# EAGLE design untitled (EAGLE 9.6.2)
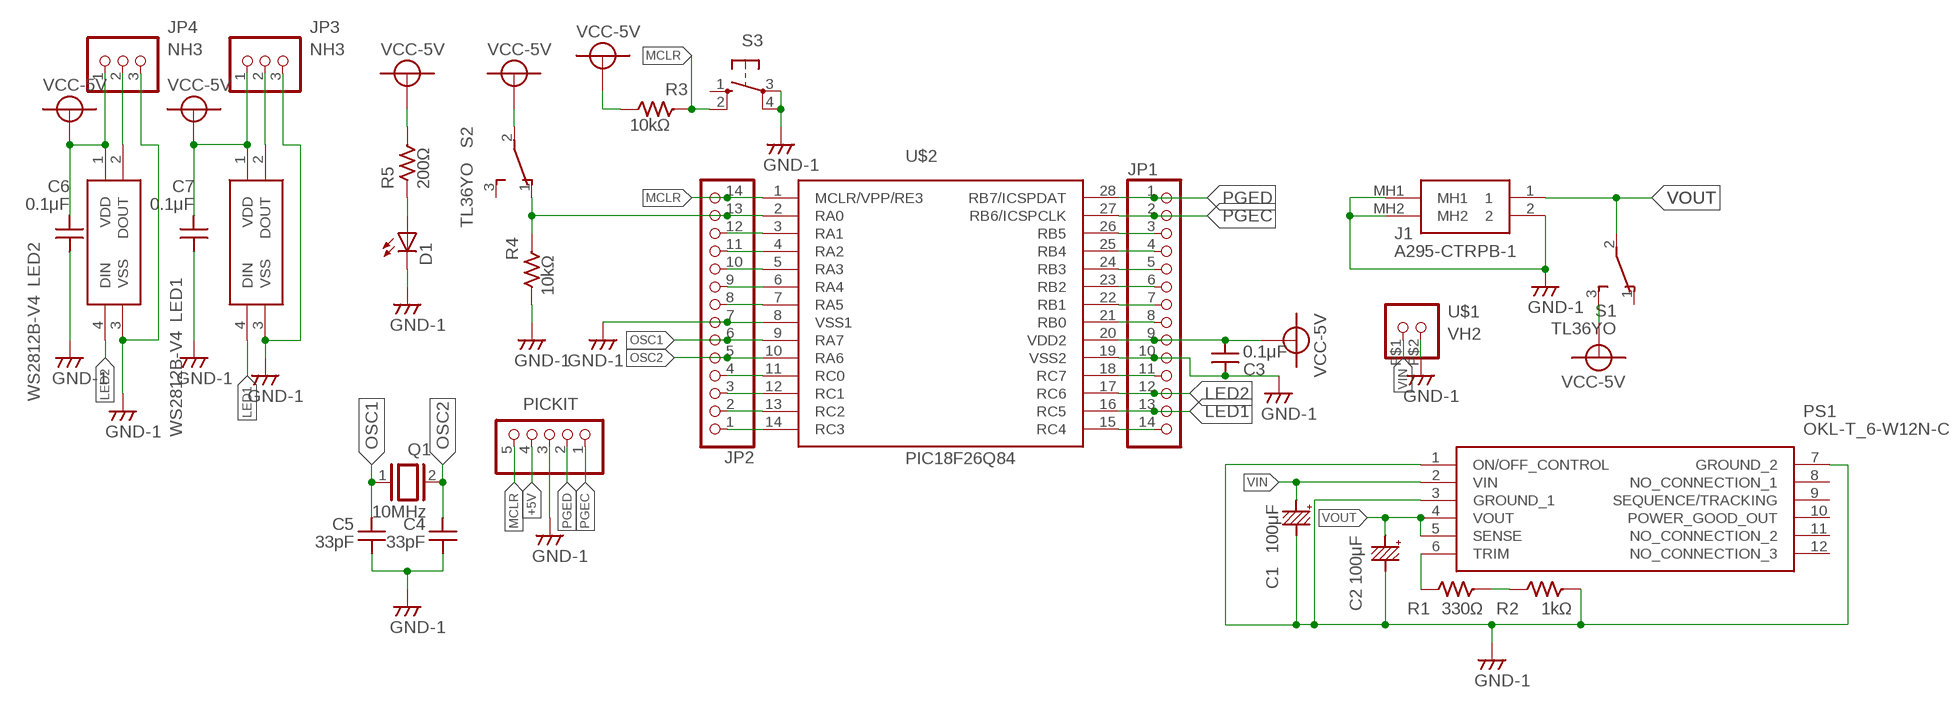
[diagram p0: schematic, sheet 1]

## Parts
C1  100μF  C+25V100  [CC:3]
C2  100μF  C+25V100  [CC:3]
C3  0.1μF  CC2.54  [C:1]
C4  33pF  CC2.54  [C:1]
C5  33pF  CC2.54  [C:1]
C6  0.1μF  CC1068  [C1608]
C7  0.1μF  CC1068  [C1608]
D1  LED""""  [CHIPLED_0603]
J1  A295-CTRPB-1  [A295CTRPB1]
JP1  PINHD-1X14  [1X14]
JP2  PINHD-1X14  [1X14]
JP3  NH3  [NH3]
JP4  NH3  [NH3]
LED1  WS2812B-V4  [WS2812BV4]
LED2  WS2812B-V4  [WS2812BV4]
PICKIT  PINHD-1X5/90  [1X05/90]
PS1  OKL-T_6-W12N-C  [OKLT6W12NC]
Q1  10MHz  XTAL/S  [QS]
R1  330Ω  R3216(1206)  [C3216]
R2  1kΩ  R2012  [2012]
R3  10kΩ  R2012  [2012]
R4  10kΩ  R2012  [2012]
R5  200Ω  R3216(1206)  [C3216]
S1  TL36YO  [TL3XYO]
S2  TL36YO  [TL3XYO]
S3  10-XX  [B3F-10XX]
U$1  VH2  [VH2]
U$2  PIC18F26Q84  [DIL28-3]

## Nets
+5V: C3.P$1 C6.2 C7.2 JP1.9 JP3.1 JP4.1 LED1.1(VDD) LED2.1(VDD) PICKIT.4 R3.1 R5.2 S1.3(S) S2.2(P) U$2.20(VDD2) ; supply symbol labelled VCC-5V
GND: C1.-(P$2-) C2.-(P$2-) C3.P$2 C4.P$1 C5.P$1 C6.1 C7.1 D1.C J1.2 J1.MH1 J1.MH2 JP1.10 JP2.7 JP3.3 JP4.3 LED1.3(VSS) LED2.3(VSS) PICKIT.3 PS1.1(ON/OFF_CONTROL) PS1.3(GROUND_1) PS1.7(GROUND_2) R2.2 R4.1 S3.3(P) S3.4(P1) U$1.P$2 U$2.8(VSS1) U$2.19(VSS2) ; supply symbol labelled GND-1
LED1: JP1.13 LED1.4(DIN) U$2.16(RC5)
LED2: JP1.12 LED2.4(DIN) U$2.17(RC6)
MCLR: JP2.14 PICKIT.5 R3.2 S3.2(S1) U$2.1(MCLR/VPP/RE3)
N$2: JP4.2 LED2.2(DOUT)
N$3: JP2.13 R4.2 S2.1(O) U$2.2(RA0)
N$4: JP2.12 U$2.3(RA1)
N$5: JP2.11 U$2.4(RA2)
N$6: JP2.10 U$2.5(RA3)
N$7: JP2.9 U$2.6(RA4)
N$8: JP2.8 U$2.7(RA5)
N$9: PS1.6(TRIM) R1.1
N$10: R1.2 R2.1
N$12: JP2.4 U$2.11(RC0)
N$13: JP2.3 U$2.12(RC1)
N$14: JP2.2 U$2.13(RC2)
N$15: JP2.1 U$2.14(RC3)
N$16: D1.A R5.1
N$17: JP1.8 U$2.21(RB0)
N$18: JP3.2 LED1.2(DOUT)
N$19: JP1.7 U$2.22(RB1)
N$20: JP1.6 U$2.23(RB2)
N$21: JP1.5 U$2.24(RB3)
N$22: JP1.4 U$2.25(RB4)
N$23: JP1.3 U$2.26(RB5)
N$26: JP1.11 U$2.18(RC7)
N$29: JP1.14 U$2.15(RC4)
OSC1: C5.P$2 JP2.6 Q1.1 U$2.9(RA7)
OSC2: C4.P$2 JP2.5 Q1.2 U$2.10(RA6)
PGEC: JP1.2 PICKIT.1 U$2.27(RB6/ICSPCLK)
PGED: JP1.1 PICKIT.2 U$2.28(RB7/ICSPDAT)
VIN: C1.+(P$1+) PS1.2(VIN) U$1.P$1
VOUT: C2.+(P$1+) J1.1 PS1.4(VOUT) PS1.5(SENSE) S1.2(P)
Unconnected: PS1.8(NO_CONNECTION_1) PS1.9(SEQUENCE/TRACKING) PS1.10(POWER_GOOD_OUT) PS1.11(NO_CONNECTION_2) PS1.12(NO_CONNECTION_3) S1.1(O) S2.3(S) S3.1(S)

## Library data of the parts
C1 C2 = Robocon-RLC:C+: Condensare
C3-C7 = Robocon-RLC:CC: Ceramic Condensare
D1 = Robocon-Diode:LED
J1 = TypeC:A295-CTRPB-1: USB Type-C connector for power supply Source: Datasheet <https://akizukidenshi.com/download/ds/changenn/A295-CTRPB-1.pdf>; DESCRIPTION: USB Type-C connector for power supply; HEIGHT: 3.36mm; MANUFACTURER_NAME: Enn Corp; MANUFACTURER_PART_NUMBER: A295-CTRPB-1
JP1 JP2 = Robocon-Pin_Header:PINHD-1X14: PIN HEADER
JP3 JP4 = Robocon-Connector:NH3
LED1 LED2 = WS2812B-V4:WS2812B-V4: Programmable LED; SMD; 5050,PLCC4; RGB; 5x5x1.57mm; 3.75.3V Source: Datasheet <https://wwwhttps://www.tme.eu/Document/37f94e8eed0435a50244cd311122890b/WS2812B-V4.pdf.tme.eu/Document/37f94e8eed0435a50244cd311122890b/WS2812B-V4.pdf>; DESCRIPTION: Programmable LED; SMD; 5050,PLCC4; RGB; 5x5x1.57mm; 3.75.3V; HEIGHT: 1.62mm; MANUFACTURER_NAME: Worldsemi; MANUFACTURER_PART_NUMBER: WS2812B-V4
PICKIT = Robocon-Pin_Header:PINHD-1X5: PIN HEADER
PS1 = DCDC:OKL-T_6-W12N-C: Non-Isolated DC/DC Converters 12Vin .59-5.5Vout 6A 30W Neg Polarity Source: Datasheet <https://componentsearchengine.com/Datasheets/2/OKL-T_6-W12N-C.pdf>; ARROW_PART_NUMBER: OKL-T/6-W12N-C; ARROW_PRICE-STOCK: https://www.arrow.com/en/products/okl-t6-w12n-c/murata-power-solutions?region=nac; DESCRIPTION: Non-Isolated DC/DC Converters 12Vin .59-5.5Vout 6A 30W Neg Polarity; HEIGHT: 7.2mm; MANUFACTURER_NAME: Murata Electronics; MANUFACTURER_PART_NUMBER: OKL-T/6-W12N-C; MOUSER_PART_NUMBER: 580-OKL-T/6-W12N-C; MOUSER_PRICE-STOCK: https://www.mouser.co.uk/ProductDetail/Murata-Power-Solutions/OKL-T-6-W12N-C?qs=b1CvEdhOXIYZVD7gV2R3gw%3D%3D
Q1 = Robocon-Other:XTAL/S: CRYSTAL
R1-R5 = Robocon-RLC:R: Resistor
S1 S2 = Robocon-Switches:TL36YO: TINY SWITCH ON - ON Source: http://www2.produktinfo.conrad.com/datenblaetter/700000-724999/705152-da-01-de-Subminiaturschalter_TL_36YO.pdf
S3 = Robocon-Switches:10-XX: OMRON SWITCH; MPN: B3F-1000; OC_FARNELL: 176432; OC_NEWARK: 36M3542
U$1 = Robocon-Connector:VH2
U$2 = Robocon-PICMicroController:PIC18F26Q84

## Net classes
0 default: clearance 0.21 mm

## Board
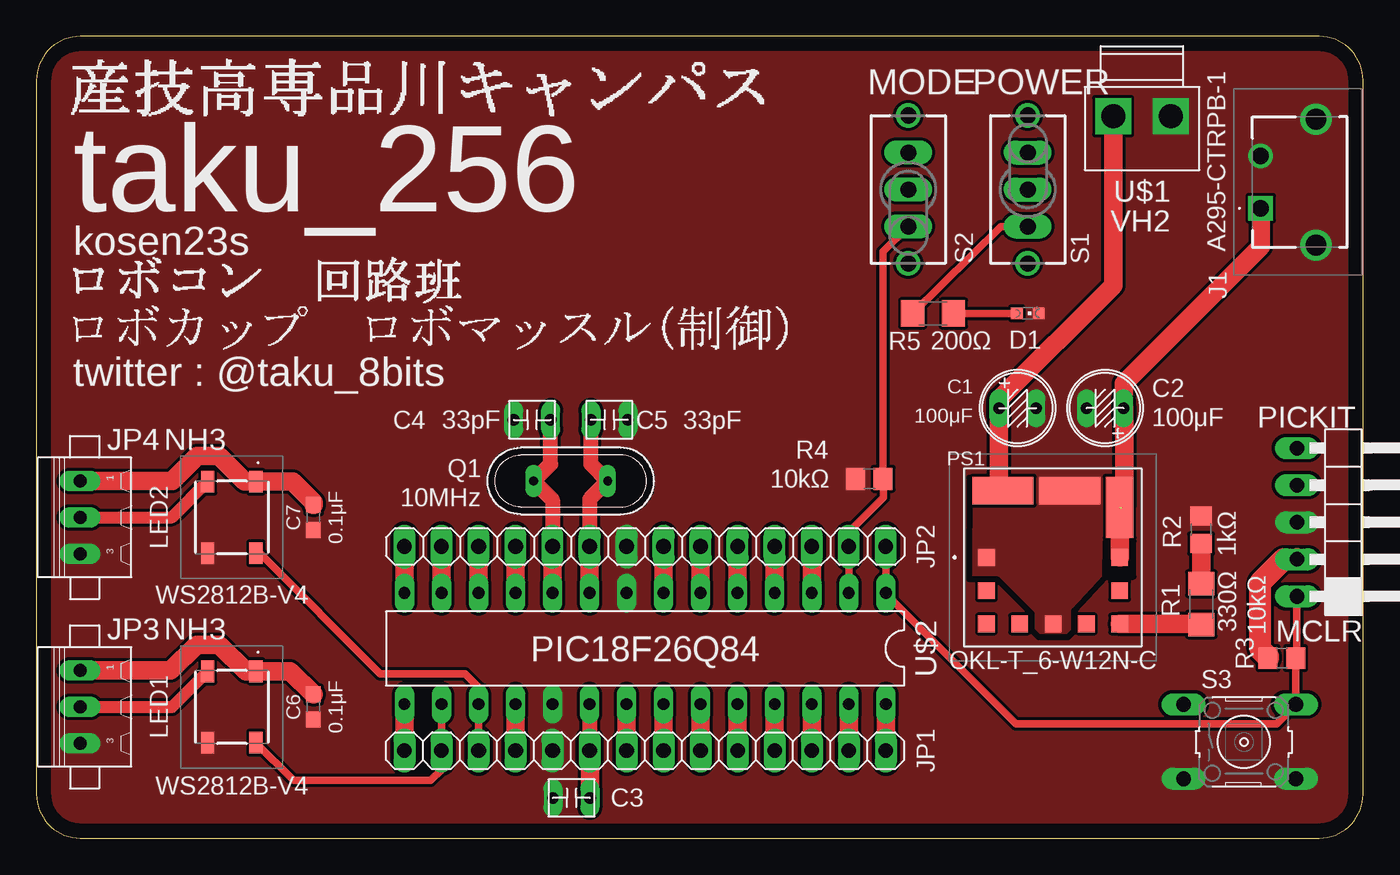
[diagram p1: board, top side]
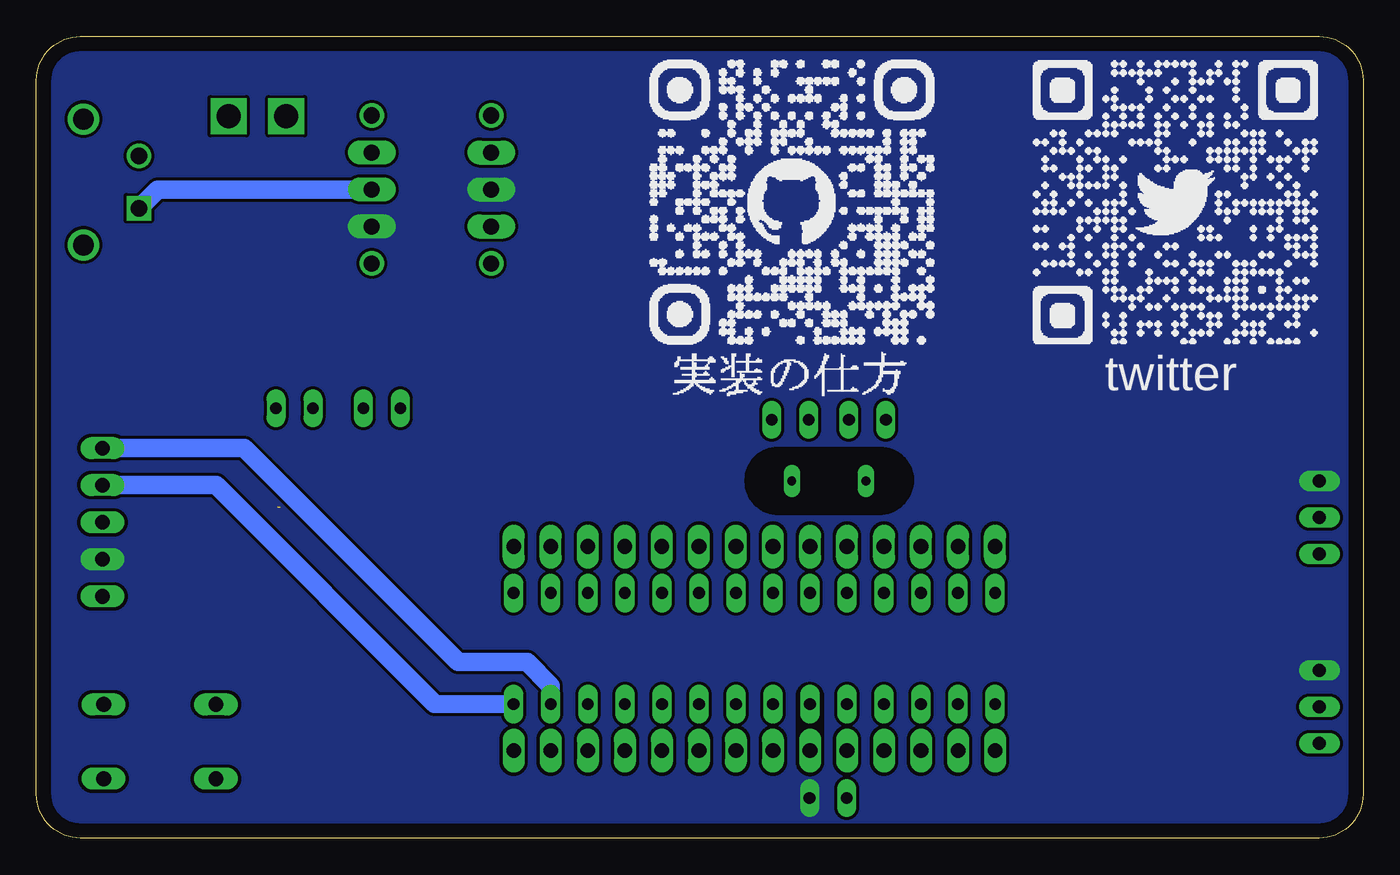
[diagram p2: board, bottom side, seen from below]

Size 91 x 55 mm. Coordinates in mm from the lower left corner, seen from the top.
Outline: 0,52 0,3 arc90 3,0 88,0 arc90 91,3 91,52 arc90 88,55 3,55 arc90 0,52
Copper layers (1*16): Top 0.035mm / dielectric 1.5mm / Bottom 0.035mm
Design rules "default": minimum track width 6mil, minimum drill 0.35mm, track to track 6mil, track to pad 6mil, pad to pad 6mil, via to via 6mil, smd to smd 6mil, copper to edge 40mil, drill to drill 6mil, minimum pad ring 10mil, minimum via ring 8mil, stop-mask expansion 4mil, vias tented up to drill 0mil, thermal gap 10mil
tRestrict: area 31,22.3 to 42.3,26.7; 12 lines
bRestrict: area 30.9,22.3 to 42.3,26.7; area 37,4.3 to 38.8,10.7

### Footprints (pad centres in the part's own frame; a part is rotated, then mirrored left to right if it is on the bottom)
CC:3 = drill 0.8 long: + -1.27,0; - 1.27,0
C:1 = drill 0.8 long: P$1 -1.27,0; P$2 1.27,0
C1608 = smd 1.1 x 1: 1 -0.85,0; 2 0.85,0
CHIPLED_0603 = smd 0.8 x 0.8: A 0,-0.75; C 0,0.75
A295CTRPB1 = drill 1.12 pad 1.68 square: 1 0,0 | drill 1.12 pad 1.68: 2 3.6,0 | drill 1.43 pad 2.145: MH1 -2.52,-3.8; MH2 6.12,-3.8
1X14 = drill 1.016 long: 1 -16.51,0; 2 -13.97,0; 3 -11.43,0; 4 -8.89,0; 5 -6.35,0; 6 -3.81,0; 7 -1.27,0; 8 1.27,0; 9 3.81,0; 10 6.35,0; 11 8.89,0; 12 11.43,0; 13 13.97,0; 14 16.51,0
NH3 = drill 0.9 long: 1 2.5,0.3; 2 0,0.3; 3 -2.5,0.3
WS2812BV4 = smd 1.5 x 0.9: 1 -2.45,1.65; 2 -2.45,-1.65; 3 2.45,-1.65; 4 2.45,1.65
1X05/90 = drill 1.016 long: 1 -5.08,-3.81; 2 -2.54,-3.81; 3 0,-3.81; 4 2.54,-3.81; 5 5.08,-3.81
OKLT6W12NC = smd 1.145 x 1.145: 1 -4.57,0; 5 4.57,0; 6 4.57,-4.57; 7 0,-4.57; 8 -2.29,-4.57; 9 -4.57,-4.57; 10 -4.57,-2.29; 11 4.57,-2.29; 12 2.29,-4.57 | smd 4.19 x 1.905: 2 -3.43,4.57; 3 1.14,4.57 | smd 1.905 x 4.19: 4 4.57,3.43
QS = drill 0.61 long: 1 -2.54,0; 2 2.54,0
C3216 = smd 1.6 x 1.8: 1 -1.4,0; 2 1.4,0
2012 = smd 1.3 x 1.5: 1 -0.953,0; 2 0.953,0
TL3XYO = drill 1.1 pad 1.422 long: 1 -2.54,0; 2 0,0; 3 2.54,0 | drill 1.1 pad 1.676: M1 -5.08,0; M2 5.08,0
B3F-10XX = drill 1.016 long: 1 -2.553,2.578; 2 5.156,2.578; 3 -2.553,-2.515; 4 5.156,-2.515
VH2 = drill 1.65 square: P$1 -1.98,-0.55; P$2 1.98,-0.55
DIL28-3 = drill 0.813 long: 1 -16.51,-3.81; 2 -13.97,-3.81; 3 -11.43,-3.81; 4 -8.89,-3.81; 5 -6.35,-3.81; 6 -3.81,-3.81; 7 -1.27,-3.81; 8 1.27,-3.81; 9 3.81,-3.81; 10 6.35,-3.81; 11 8.89,-3.81; 12 11.43,-3.81; 13 13.97,-3.81; 14 16.51,-3.81; 15 16.51,3.81; 16 13.97,3.81; 17 11.43,3.81; 18 8.89,3.81; 19 6.35,3.81; 20 3.81,3.81; 21 1.27,3.81; 22 -1.27,3.81; 23 -3.81,3.81; 24 -6.35,3.81; 25 -8.89,3.81; 26 -11.43,3.81; 27 -13.97,3.81; 28 -16.51,3.81

### Placement (x,y rotation side)
C1  67.3,29.5 0 top
C2  73.3,29.5 180 top
C3  36.7,2.75 180 top
C4  34,28.7 0 top
C5  39.3,28.7 180 top
C6  19,9 90 top
C7  19,22 90 top
D1  68,36 270 top
J1  83.97,43.21 90 top
JP1  41.75,6 180 top
JP2  41.75,20 0 top
JP3  3.3,9 90 top
JP4  3.3,22 90 top
LED1  13.4,9 270 top
LED2  13.4,22 270 top
PICKIT  90.28,21.67 270 top
PS1  69.73,19.26 0 top
Q1  36.65,24.5 180 top
R1  79.91,16.05 90 top
R2  79.89,21.16 90 top
R3  85.43,12.35 0 top
R4  57.12,24.65 0 top
R5  61.5,36 180 top
S1  68,44.5 270 top
S2  59.8,44.5 90 top
S3  81.24,6.59 0 top
U$1  75.84,50.08 0 top
U$2  41.75,13 180 top
U$10  [HOWTOMAKE]  48.28,29.58 0 bottom
U$11  [TMCIT]  1.36,49.3 0 top
U$13  [TWITTER]  22.7,33.85 0 bottom
U$14  [MEISHI-GIT-QR]  48.99,33.85 0 bottom
U$15  [ROBOCON]  2.21,36.47 0 top
U$16  [ROBOMUSCLE]  2.12,33.06 0 top

### Tracks (layer width: path | path; a pad name or v marks a point on that pad's centre or on a via)
+5V
  Top 0.508: S1.3 66.14,41.96 R5.2
  Top 1.016: U$2.20 JP1.9
  Top 1.27: JP4.1 9.3,24.5 11.02,26.21 12.52,26.21 14.29,24.45 LED2.1 | LED2.1 17.57,24.45 19,23.02 C7.2 | JP3.1 9.22,11.5 10.99,13.27 12.55,13.27 14.37,11.45 LED1.1 17.4,11.45 C6.2 | LED2.1 15.05,24.36 | C3.P$1 37.97,5.97 JP1.9
  Top 1.5: 86.44,19.1 PICKIT.4 85.53,19.13 83.96,17.55 83.96,12.95 84.48,12.44 R3.1
  pour Bottom (rank 6, no thermals): -0.43,55.37 -0.43,-0.64 91.63,-0.64 91.63,55.37
GND
  Top 1.27: 77.79,49.5 U$1.P$2
  pour Top (rank 6, no thermals): -0.97,56.3 -0.97,-1.25 92.1,-1.25 92.1,56.3
LED1
  Top 0.508: LED1.4 17.65,3.95 27.05,3.95 27.78,4.68 JP1.13 U$2.16
LED2
  Top 0.508: LED2.4 15.31,19.55 23.59,11.27 29.4,11.27 30.32,10.35 U$2.17 JP1.12
MCLR
  Top 0.508: JP2.14 U$2.1 58.26,16.74 67.19,7.84 85.07,7.84 S3.2 86.38,9.18 R3.2 86.47,12.44 PICKIT.5
N$2
  Top 0.813: JP4.2 9.3,22 LED2.2
N$3
  Top 0.508: U$2.2 JP2.13 55.72,21 58.1,23.38 58.1,24.62 R4.2 58.07,40.23 S2.1
N$4
  Top 1.27: JP2.12 U$2.3
N$5
  Top 1.27: JP2.11 U$2.4
N$6
  Top 1.27: JP2.10 U$2.5
N$7
  Top 1.27: JP2.9 U$2.6
N$8
  Top 1.27: JP2.8 U$2.7
N$9
  Top 1.27: PS1.6 79.87,14.69 R1.1
N$10
  Top 1.27: R1.2 79.91,20.19 R2.1
N$12
  Top 1.27: JP2.4 U$2.11
N$13
  Top 1.27: JP2.3 U$2.12
N$14
  Top 1.27: JP2.2 U$2.13
N$15
  Top 1.27: JP2.1 U$2.14
N$16
  Top 0.508: R5.1 67.42,35.99 D1.A
N$17
  Top 1.27: U$2.21 JP1.8
N$18
  Top 0.813: JP3.2 9.3,9 LED1.2
N$19
  Top 1.27: U$2.22 JP1.7
N$20
  Top 1.27: U$2.23 JP1.6
N$21
  Top 1.27: U$2.24 JP1.5
N$22
  Top 1.27: U$2.25 JP1.4
N$23
  Top 1.27: U$2.26 JP1.3
N$26
  Top 1.27: U$2.18 JP1.11
N$29
  Top 1.27: U$2.15 JP1.14
OSC1
  Top 1.016: C5.P$2 38.03,25.66 Q1.1 37.94,23.25 JP2.6
  Top 1.27: U$2.9 JP2.6 38,20.14
OSC2
  Top 1.016: C4.P$2 35.27,25.66 Q1.2 35.4,23.21 JP2.5
  Top 1.27: JP2.5 U$2.10
PGEC
  Top 1.27: U$2.27 JP1.2
  Bottom 1.27: PICKIT.1 76.75,26.75 62.09,12.09 57.35,12.09 55.72,10.46 U$2.27
PGED
  Top 1.27: U$2.28 JP1.1
  Bottom 1.27: PICKIT.2 78.68,24.21 63.69,9.22 U$2.28
VIN
  Top 1.27: PS1.2 65.99,24.14 66.03,24.18 C1.+ 66.02,30.07 73.86,37.91 U$1.P$1
VOUT  (1 unrouted)
  Top 1.27: J1.1 83.98,40.58 74.6,31.2 C2.+ 74.61,29.52 74.61,22.86 74.45,22.7 | PS1.5 PS1.4 74.51,22.9
  Bottom 1.27: J1.1 82.67,44.5 S1.2

### Text on the board
tPlace: MODE | POWER | kosen23s / / / twitter : @taku_8bits
bPlace: twitter
tNames: U$1 | taku_256 | VH2 | JP4 | NH3 | MCLR | JP3 | NH3